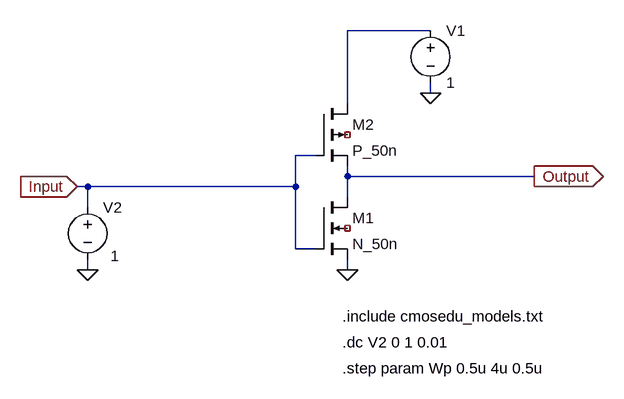
[diagram p0: schematic EXP_2.asc]
EXP_2.asc, the LTspice schematic file:
Version 4
SHEET 1 880 680
WIRE 320 -80 192 -80
WIRE 320 16 320 0
WIRE 192 32 192 -80
WIRE 144 112 112 112
WIRE 192 144 192 128
WIRE 480 144 192 144
WIRE -208 160 -224 160
WIRE 112 160 112 112
WIRE 112 160 -208 160
WIRE 192 176 192 144
WIRE -208 192 -208 160
WIRE 112 256 112 160
WIRE 144 256 112 256
WIRE -208 288 -208 272
WIRE 192 288 192 272
FLAG 192 288 0
FLAG 320 16 0
FLAG -224 160 Input
IOPIN -224 160 In
FLAG 480 144 Output
IOPIN 480 144 Out
FLAG -208 288 0
SYMBOL nmos4 144 176 R0
SYMATTR InstName M1
SYMATTR Value N_50n
SYMATTR Value2 l=50n w=0.5u
SYMBOL pmos4 144 32 R0
SYMATTR InstName M2
SYMATTR Value P_50n
SYMATTR Value2 l=50n w={Wp}
SYMBOL voltage 320 -96 R0
WINDOW 123 0 0 Left 0
WINDOW 39 0 0 Left 0
SYMATTR InstName V1
SYMATTR Value 1
SYMBOL voltage -208 176 R0
WINDOW 3 35 91 Left 2
WINDOW 123 0 0 Left 0
WINDOW 39 0 0 Left 0
SYMATTR Value 1
SYMATTR InstName V2
TEXT 184 360 Left 2 !.include cmosedu_models.txt
TEXT 184 400 Left 2 !.dc V2 0 1 0.01
TEXT 184 440 Left 2 !.step param Wp 0.5u 4u 0.5u

The netlist it stands for:
* EXP_2.asc
M1 Output Input 0 NC_01 N_50n l=50n w=0.5u
M2 N001 Input Output NC_02 P_50n l=50n w={Wp}
V1 N001 0 1
V2 Input 0 1
.model NMOS NMOS
.model PMOS PMOS
.lib standard.mos
.include cmosedu_models.txt
.dc V2 0 1 0.01
.step param Wp 0.5u 4u 0.5u
.backanno
.end